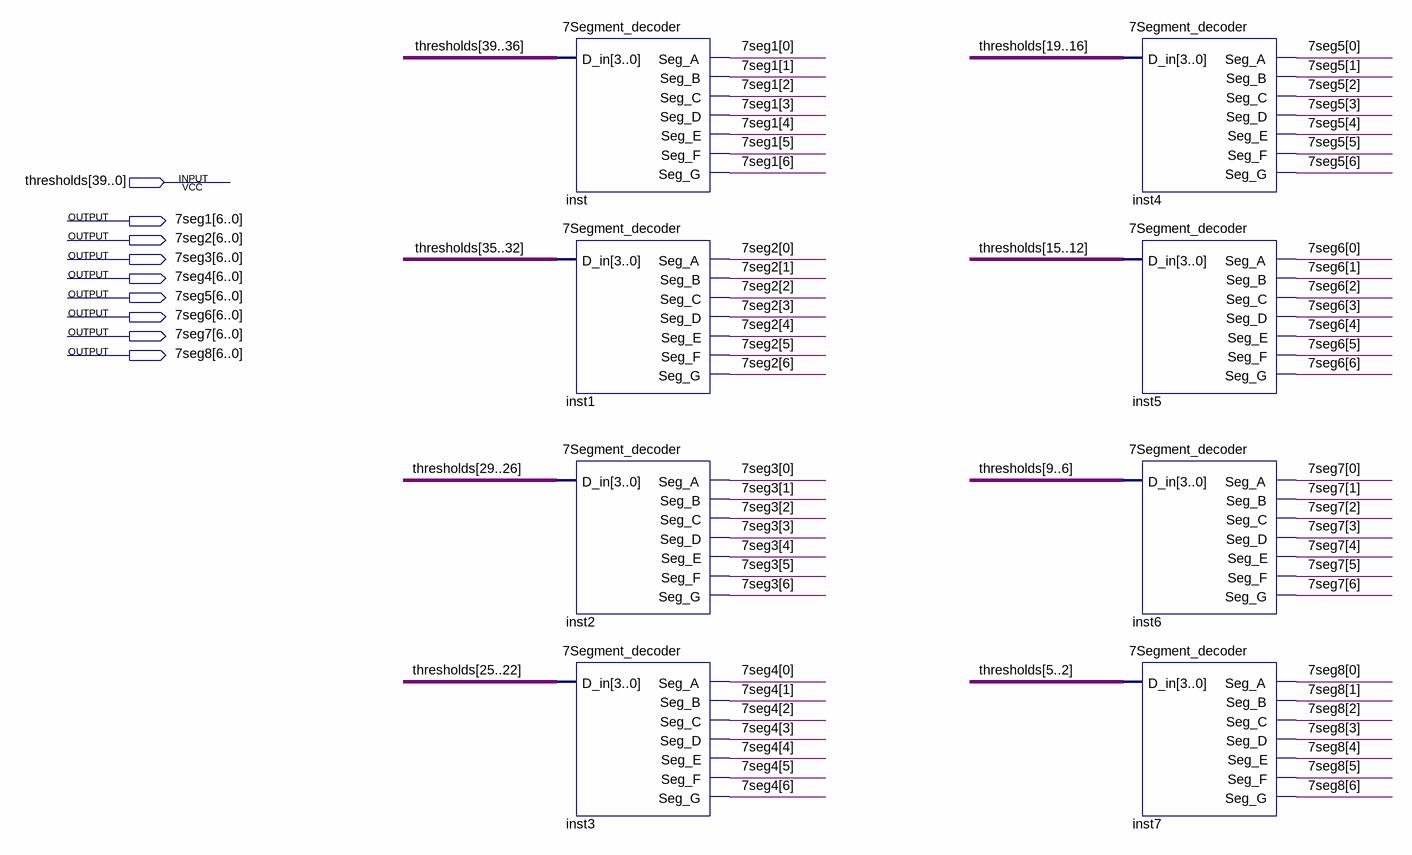
[diagram p0: schematic sheet]
// Quartus schematic threshold_to_7seg.bdf as structural Verilog: 8 symbols, 9 pins
module threshold_to_7seg (
  input  [39:0] thresholds,
  output [6:0] \7seg1 ,
  output [6:0] \7seg2 ,
  output [6:0] \7seg3 ,
  output [6:0] \7seg4 ,
  output [6:0] \7seg5 ,
  output [6:0] \7seg6 ,
  output [6:0] \7seg7 ,
  output [6:0] \7seg8 
);

  \7Segment_decoder  inst (
    .D_in(thresholds[39:36]), .Seg_A(\7seg1 [0]), .Seg_B(\7seg1 [1]), .Seg_C(\7seg1 [2]), .Seg_D(\7seg1 [3]),
    .Seg_E(\7seg1 [4]), .Seg_F(\7seg1 [5]), .Seg_G(\7seg1 [6]));
  \7Segment_decoder  inst1 (
    .D_in(thresholds[35:32]), .Seg_A(\7seg2 [0]), .Seg_B(\7seg2 [1]), .Seg_C(\7seg2 [2]), .Seg_D(\7seg2 [3]),
    .Seg_E(\7seg2 [4]), .Seg_F(\7seg2 [5]), .Seg_G(\7seg2 [6]));
  \7Segment_decoder  inst2 (
    .D_in(thresholds[29:26]), .Seg_A(\7seg3 [0]), .Seg_B(\7seg3 [1]), .Seg_C(\7seg3 [2]), .Seg_D(\7seg3 [3]),
    .Seg_E(\7seg3 [4]), .Seg_F(\7seg3 [5]), .Seg_G(\7seg3 [6]));
  \7Segment_decoder  inst3 (
    .D_in(thresholds[25:22]), .Seg_A(\7seg4 [0]), .Seg_B(\7seg4 [1]), .Seg_C(\7seg4 [2]), .Seg_D(\7seg4 [3]),
    .Seg_E(\7seg4 [4]), .Seg_F(\7seg4 [5]), .Seg_G(\7seg4 [6]));
  \7Segment_decoder  inst4 (
    .D_in(thresholds[19:16]), .Seg_A(\7seg5 [0]), .Seg_B(\7seg5 [1]), .Seg_C(\7seg5 [2]), .Seg_D(\7seg5 [3]),
    .Seg_E(\7seg5 [4]), .Seg_F(\7seg5 [5]), .Seg_G(\7seg5 [6]));
  \7Segment_decoder  inst5 (
    .D_in(thresholds[15:12]), .Seg_A(\7seg6 [0]), .Seg_B(\7seg6 [1]), .Seg_C(\7seg6 [2]), .Seg_D(\7seg6 [3]),
    .Seg_E(\7seg6 [4]), .Seg_F(\7seg6 [5]), .Seg_G(\7seg6 [6]));
  \7Segment_decoder  inst6 (
    .D_in(thresholds[9:6]), .Seg_A(\7seg7 [0]), .Seg_B(\7seg7 [1]), .Seg_C(\7seg7 [2]), .Seg_D(\7seg7 [3]),
    .Seg_E(\7seg7 [4]), .Seg_F(\7seg7 [5]), .Seg_G(\7seg7 [6]));
  \7Segment_decoder  inst7 (
    .D_in(thresholds[5:2]), .Seg_A(\7seg8 [0]), .Seg_B(\7seg8 [1]), .Seg_C(\7seg8 [2]), .Seg_D(\7seg8 [3]),
    .Seg_E(\7seg8 [4]), .Seg_F(\7seg8 [5]), .Seg_G(\7seg8 [6]));
endmodule
